# Altium schematic sheet I2C.SchDoc
size A4
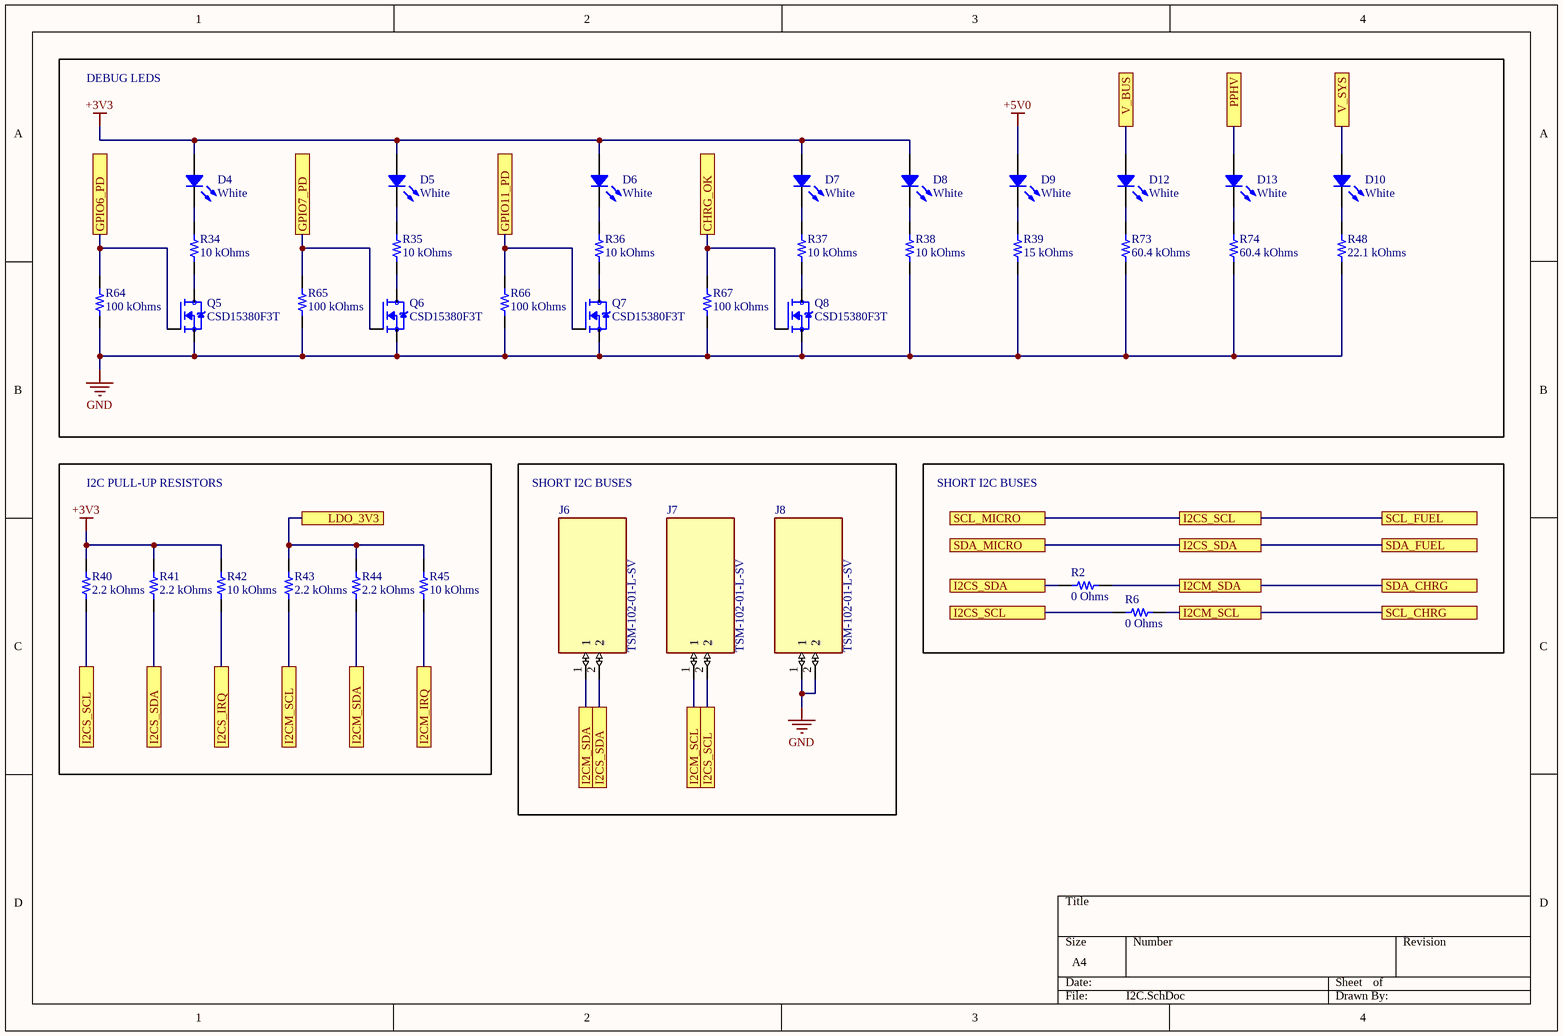
[diagram p0: I2C.SchDoc]

## Parts
D4  White  [LED 0805_2012]  (no BOM)
D5  White  [LED 0805_2012]  (no BOM)
D6  White  [LED 0805_2012]  (no BOM)
D7  White  [LED 0805_2012]  (no BOM)
D8  White  [LED 0805_2012]  (no BOM)
D9  White  [LED 0805_2012]  (no BOM)
D10  White  [LED 0805_2012]  (no BOM)
D12  White  [LED 0805_2012]  (no BOM)
D13  White  [LED 0805_2012]  (no BOM)
J6  TSM-102-01-L-SV  [TSM-102-01-L-SV]  (no BOM)
J7  TSM-102-01-L-SV  [TSM-102-01-L-SV]  (no BOM)
J8  TSM-102-01-L-SV  [TSM-102-01-L-SV]  (no BOM)
Q5  CSD15380F3T  [TRXDFN69X60X35-3N]  (no BOM)
Q6  CSD15380F3T  [TRXDFN69X60X35-3N]  (no BOM)
Q7  CSD15380F3T  [TRXDFN69X60X35-3N]  (no BOM)
Q8  CSD15380F3T  [TRXDFN69X60X35-3N]  (no BOM)
R2  0 Ohms  [RES 0402_1005]
R6  0 Ohms  [RES 0402_1005]
R34  10 kOhms  [RES 0603_1608]  (no BOM)
R35  10 kOhms  [RES 0603_1608]  (no BOM)
R36  10 kOhms  [RES 0603_1608]  (no BOM)
R37  10 kOhms  [RES 0603_1608]  (no BOM)
R38  10 kOhms  [RES 0603_1608]  (no BOM)
R39  15 kOhms  [RES 0402_1005]  (no BOM)
R40  2.2 kOhms  [RES 0402_1005]
R41  2.2 kOhms  [RES 0402_1005]
R42  10 kOhms  [RES 0402_1005]
R43  2.2 kOhms  [RES 0402_1005]
R44  2.2 kOhms  [RES 0402_1005]
R45  10 kOhms  [RES 0402_1005]
R48  22.1 kOhms  [RES 0603_1608]  (no BOM)
R64  100 kOhms  [RES 0402_1005]  (no BOM)
R65  100 kOhms  [RES 0402_1005]  (no BOM)
R66  100 kOhms  [RES 0402_1005]  (no BOM)
R67  100 kOhms  [RES 0402_1005]  (no BOM)
R73  60.4 kOhms  [RES 0603_1608]  (no BOM)
R74  60.4 kOhms  [RES 0603_1608]  (no BOM)

## Blocks framed on the sheet
DEBUG LEDS: D4-D10 D12 D13 Q5-Q8 R34-R39 R48 R64-R67 R73 R74
I2C PULL-UP RESISTORS: R40-R45
SHORT I2C BUSES: J6-J8
SHORT I2C BUSES: R2 R6

## Ports
CHRG_OK, GPIO6_PD, GPIO7_PD, GPIO11_PD, I2CM_IRQ, I2CM_SCL, I2CM_SDA, I2CS_IRQ, I2CS_SCL, I2CS_SDA, LDO_3V3, PPHV, SCL_CHRG, SCL_FUEL, SCL_MICRO, SDA_CHRG, SDA_FUEL, SDA_MICRO, V_BUS, V_SYS

## Nets
+3V3: D4.1 D5.1 D6.1 D7.1 D8.1 R40.2 R41.2 R42.2
+5V0: D9.1
GND: J8.1 J8.2 Q5.2(S) Q6.2(S) Q7.2(S) Q8.2(S) R38.1 R39.1 R48.1 R64.1 R65.1 R66.1 R67.1 R73.1 R74.1
CHRG_OK: Q8.1(G) R67.2 ; port CHRG_OK
GPIO6_PD: Q5.1(G) R64.2 ; port GPIO6_PD
GPIO7_PD: Q6.1(G) R65.2 ; port GPIO7_PD
GPIO11_PD: Q7.1(G) R66.2 ; port GPIO11_PD
I2CM_IRQ: R45.1 ; port I2CM_IRQ
I2CM_SCL: J7.1 R6.2 R43.1 ; port SCL_CHRG, port I2CM_SCL
I2CM_SDA: J6.1 R2.2 R44.1 ; port SDA_CHRG, port I2CM_SDA
I2CS_IRQ: R42.1 ; port I2CS_IRQ
I2CS_SCL: J7.2 R6.1 R40.1 ; port SCL_MICRO, port I2CS_SCL, port SCL_FUEL
I2CS_SDA: J6.2 R2.1 R41.1 ; port SDA_MICRO, port I2CS_SDA, port SDA_FUEL
LDO_3V3: R43.2 R44.2 R45.2 ; port LDO_3V3
PPHV: D13.1 ; port PPHV
V_BUS: D12.1 ; port V_BUS
V_SYS: D10.1 ; port V_SYS
NetD4_2: D4.2 R34.2
NetD5_2: D5.2 R35.2
NetD6_2: D6.2 R36.2
NetD7_2: D7.2 R37.2
NetD8_2: D8.2 R38.2
NetD9_2: D9.2 R39.2
NetD10_2: D10.2 R48.2
NetD12_2: D12.2 R73.2
NetD13_2: D13.2 R74.2
NetQ5_3: Q5.3(D) R34.1
NetQ6_3: Q6.3(D) R35.1
NetQ7_3: Q7.3(D) R36.1
NetQ8_3: Q8.3(D) R37.1

## Library data of the parts
D4-D10 D12 D13 = QBLP631-IW5: 0805 LED WHITE, YELLOW DIFFUSED; Manufacturer: QT Brightek (QTB); Configuration: Standard; Current - Test: 5mA; Lens Size: 1.30mm x 1.25mm; Lens Style: Rectangle with Flat Top; Millicandela Rating: 85mcd; Viewing Angle: 140°; Voltage - Forward (Vf) (Typ): 2.9V; Part Number: QBLP631-IW5; Color: White; ComponentLink1Description: Datasheet; ComponentLink1URL: https://www.qt-brightek.com/datasheet/QBLP631-IW5.pdf; ComponentLink2Description: DigiKey Link; ComponentLink2URL: https://www.digikey.com/en/products/detail/qt-brightek-qtb/QBLP631-IW5/16499651; Device Package: 0805 (2012 Metric); Height (Max): 0.90mm; LastUpdated: 9/08/2022 12:43:05 PM; Lens Color: Yellow; Lens Transparency: Diffused; Lifecycle Status: Active; Minimum Order: 1; Mounting Type: Surface Mount; Package / Case: 0805 (2012 Metric); Packaging: TapeAndReel; PartId: 1097; Part Status: Active; Price: 0.08; Series: QBLP631; Size / Dimension: 2.00mm L x 1.25mm W; Supplier 1: DigiKey; Supplier Part Number 1: 1516-QBLP631-IW5CT-ND; Supplier Device Package: 0805; Value: White
J6-J8 = TSM-102-01-L-SV: MF: {'manufacturer': u'Samtec Inc.'}; Value: *; Package: None; Price: None; MP: TSM-102-01-L-SV; Availability: Unavailable
Q5-Q8 = CSD15380F3T: 20-V N-Channel FemtoFET MOSFET 3-PICOSTAR -55 to 150; MF: {'manufacturer': u'Texas Instruments'}; Value: *; Package: None; Price: None; MP: CSD15380F3T; Availability: Unavailable
R2 R6 = CRCW04020000Z0EDHP: RES SMD 0 OHM JUMPER 1/5W 0402; Manufacturer: Vishay Dale; Power (Watts): 0.2W, 1/5W; Part Number: CRCW04020000Z0EDHP; Value: 0 Ohms; ComponentLink1Description: Datasheet; ComponentLink1URL: http://www.vishay.com/docs/20043/crcwhpe3.pdf; ComponentLink2Description: DigiKey Link; ComponentLink2URL: https://www.digikey.com/en/products/detail/vishay-dale/CRCW04020000Z0EDHP/2222496; Composition: Thick Film; Device Package: 0402 (1005 Metric); Features: Automotive AEC-Q200, Pulse Withstanding; Height - Seated (Max): 0.016" (0.40mm); LastUpdated: 7/09/2023 7:26:17 PM; Lifecycle Status: Active; Minimum Order: 1; Number of Terminations: 2; Operating Temperature: -55°C ~ 155°C; Package / Case: 0402 (1005 Metric); Packaging: TapeAndReel; PartId: 3131; Part Status: Active; Price: 0.01; Ratings: AEC-Q200; Resistance: 0 Ohms; Series: CRCW-HP; Size / Dimension: 0.039" L x 0.020" W (1.00mm x 0.50mm); Supplier 1: DigiKey; Supplier Part Number 1: 541-0.0YBCT-ND; Supplier Device Package: 0402; Tolerance: Jumper
R34-R38 = CR0603-JW-103EAS: RES 10K OHM 5% 0.01W 0603; Manufacturer: Bourns Inc.; Temperature Coefficient: ±200ppm/°C; Part Number: CR0603-JW-103EAS; Value: 10 kOhms; ComponentLink1Description: Datasheet; ComponentLink1URL: https://www.bourns.com/docs/Product-Datasheets/CR0603-AS.pdf; ComponentLink2Description: DigiKey Link; ComponentLink2URL: http://digikey.com/product-detail/en/bourns-inc/CR0603-JW-103EAS/CR0603-JW-103EASCT-ND/6830121; Composition: Thick Film; Device Package: 0603 (1608 Metric); Features: Anti-Sulfur; Height - Seated (Max): 0.024" (0.60mm); LastUpdated: 27/04/2023 7:33:47 PM; Lifecycle Status: Active; Minimum Order: 1; Number of Terminations: 2; Operating Temperature: -55°C ~ 155°C; Package / Case: 0603 (1608 Metric); Packaging: CutTape; PartId: 22277; Part Status: Active; Power (Watts): 0.01W; Price: 0.10; Resistance: 10 kOhms; Series: CR0603-AS; Size / Dimension: 0.063" L x 0.031" W (1.60mm x 0.80mm); Supplier 1: DigiKey; Supplier Part Number 1: CR0603-JW-103EASCT-ND; Supplier Device Package: 0603; Tolerance: ±5%
R39 = RC0402FR-1315KL: RES 15K OHM 1% 1/16W 0402; Manufacturer: Yageo; Power (Watts): 0.063W, 1/16W; Temperature Coefficient: ±100ppm/°C; Part Number: RC0402FR-1315KL; Value: 15 kOhms; ComponentLink1Description: Datasheet; ComponentLink1URL: https://www.yageo.com/upload/media/product/productsearch/datasheet/rchip/PYu-RC_Group_51_RoHS_L_11.pdf; ComponentLink2Description: DigiKey Link; ComponentLink2URL: https://www.digikey.com/en/products/detail/yageo/RC0402FR-1315KL/13694190; Composition: Thick Film; Device Package: 0402 (1005 Metric); Features: Moisture Resistant; Height - Seated (Max): 0.016" (0.40mm); LastUpdated: 14/08/2022 9:22:52 PM; Lifecycle Status: Active; Minimum Order: 50000; Number of Terminations: 2; Operating Temperature: -55°C ~ 155°C; Package / Case: 0402 (1005 Metric); PartId: 65094; Part Status: Active; Price: 0; Resistance: 15 kOhms; Series: RC_L; Size / Dimension: 0.039" L x 0.020" W (1.00mm x 0.50mm); Supplier 1: DigiKey; Supplier Part Number 1: 13-RC0402FR-1315KLTR-ND; Supplier Device Package: 0402; Tolerance: ±1%
R40 R41 R43 R44 = RC0402FR-132K2L: RES 2.2K OHM 1% 1/16W 0402; Manufacturer: Yageo; Power (Watts): 0.063W, 1/16W; Temperature Coefficient: ±100ppm/°C; Part Number: RC0402FR-132K2L; Value: 2.2 kOhms; ComponentLink1Description: Datasheet; ComponentLink1URL: https://www.yageo.com/upload/media/product/productsearch/datasheet/rchip/PYu-RC_Group_51_RoHS_L_11.pdf; ComponentLink2Description: DigiKey Link; ComponentLink2URL: https://www.digikey.com/en/products/detail/yageo/RC0402FR-132K2L/13694070; Composition: Thick Film; Device Package: 0402 (1005 Metric); Features: Moisture Resistant; Height - Seated (Max): 0.016" (0.40mm); LastUpdated: 26/04/2023 7:19:35 PM; Lifecycle Status: Active; Minimum Order: 50000; Number of Terminations: 2; Operating Temperature: -55°C ~ 155°C; Package / Case: 0402 (1005 Metric); PartId: 64946; Part Status: Active; Price: 0; Resistance: 2.2 kOhms; Series: RC_L; Size / Dimension: 0.039" L x 0.020" W (1.00mm x 0.50mm); Supplier 1: DigiKey; Supplier Part Number 1: 13-RC0402FR-132K2LTR-ND; Supplier Device Package: 0402; Tolerance: ±1%
R42 R45 = RC0402JR-1310KL: RES 10K OHM 5% 1/16W 0402; Manufacturer: Yageo; Power (Watts): 0.063W, 1/16W; Temperature Coefficient: ±100ppm/°C; Part Number: RC0402JR-1310KL; Value: 10 kOhms; ComponentLink1Description: Datasheet; ComponentLink1URL: https://www.yageo.com/upload/media/product/productsearch/datasheet/rchip/PYu-RC_Group_51_RoHS_L_11.pdf; ComponentLink2Description: DigiKey Link; ComponentLink2URL: https://www.digikey.com/en/products/detail/yageo/RC0402JR-1310KL/13694115; Composition: Thick Film; Device Package: 0402 (1005 Metric); Features: Moisture Resistant; Height - Seated (Max): 0.016" (0.40mm); LastUpdated: 4/04/2023 7:21:31 PM; Lifecycle Status: Active; Minimum Order: 50000; Number of Terminations: 2; Operating Temperature: -55°C ~ 155°C; Package / Case: 0402 (1005 Metric); PartId: 69237; Part Status: Active; Price: 0; Resistance: 10 kOhms; Series: RC_L; Size / Dimension: 0.039" L x 0.020" W (1.00mm x 0.50mm); Supplier 1: DigiKey; Supplier Part Number 1: 13-RC0402JR-1310KLTR-ND; Supplier Device Package: 0402; Tolerance: ±5%
R48 = RMCF0603FT22K1: RES 22.1K OHM 1% 1/10W 0603; Manufacturer: Stackpole Electronics Inc; Power (Watts): 0.1W, 1/10W; Temperature Coefficient: ±100ppm/°C; Part Number: RMCF0603FT22K1; Value: 22.1 kOhms; ComponentLink1Description: Datasheet; ComponentLink1URL: https://www.seielect.com/catalog/sei-rmcf_rmcp.pdf; ComponentLink2Description: DigiKey Link; ComponentLink2URL: https://www.digikey.com/en/products/detail/stackpole-electronics-inc/RMCF0603FT22K1/1760764; Composition: Thick Film; Device Package: 0603 (1608 Metric); Features: Automotive AEC-Q200; Height - Seated (Max): 0.022" (0.55mm); LastUpdated: 10/05/2023 7:38:01 PM; Lifecycle Status: Active; Minimum Order: 1; Number of Terminations: 2; Operating Temperature: -55°C ~ 155°C; Package / Case: 0603 (1608 Metric); Packaging: CutTape; PartId: 6076; Part Status: Active; Price: 0.01; Ratings: AEC-Q200; Resistance: 22.1 kOhms; Series: RMCF; Size / Dimension: 0.061" L x 0.031" W (1.55mm x 0.80mm); Supplier 1: DigiKey; Supplier Part Number 1: RMCF0603FT22K1CT-ND; Supplier Device Package: 0603; Tolerance: ±1%
R64-R67 = RT0402FRE07100KL: RES SMD 100K OHM 1% 1/16W 0402; Manufacturer: Yageo; Power (Watts): 0.063W, 1/16W; Temperature Coefficient: ±50ppm/°C; Part Number: RT0402FRE07100KL; Value: 100 kOhms; ComponentLink1Description: Datasheet; ComponentLink1URL: https://www.yageo.com/upload/media/product/productsearch/datasheet/rchip/PYu-RT_1-to-0.01_RoHS_L_11.pdf; ComponentLink2Description: DigiKey Link; ComponentLink2URL: https://www.digikey.com/en/products/detail/yageo/RT0402FRE07100KL/1071698; Composition: Thin Film; Device Package: 0402 (1005 Metric); Height - Seated (Max): 0.014" (0.35mm); LastUpdated: 26/04/2023 7:20:40 PM; Lifecycle Status: Active; Minimum Order: 1; Number of Terminations: 2; Operating Temperature: -55°C ~ 155°C; Package / Case: 0402 (1005 Metric); Packaging: TapeAndReel; PartId: 3190; Part Status: Active; Price: 0.01; Resistance: 100 kOhms; Series: RT; Size / Dimension: 0.039" L x 0.020" W (1.00mm x 0.50mm); Supplier 1: DigiKey; Supplier Part Number 1: YAG2307CT-ND; Supplier Device Package: 0402; Tolerance: ±1%
R73 R74 = CRCW060360K4FKEA: RES SMD 60.4K OHM 1% 1/10W 0603; Manufacturer: Vishay Dale; Power (Watts): 0.1W, 1/10W; Temperature Coefficient: ±100ppm/°C; Part Number: CRCW060360K4FKEA; Value: 60.4 kOhms; ComponentLink1Description: Datasheet; ComponentLink1URL: http://www.vishay.com/docs/20035/dcrcwe3.pdf; ComponentLink2Description: DigiKey Link; ComponentLink2URL: https://www.digikey.com/en/products/detail/vishay-dale/CRCW060360K4FKEA/1174871; Composition: Thick Film; Device Package: 0603 (1608 Metric); Features: Automotive AEC-Q200; Height - Seated (Max): 0.020" (0.50mm); LastUpdated: 7/05/2023 7:36:13 PM; Lifecycle Status: Active; Minimum Order: 1; Number of Terminations: 2; Operating Temperature: -55°C ~ 155°C; Package / Case: 0603 (1608 Metric); Packaging: CutTape; PartId: 5182; Part Status: Active; Price: 0.01; Ratings: AEC-Q200; Resistance: 60.4 kOhms; Series: CRCW; Size / Dimension: 0.061" L x 0.033" W (1.55mm x 0.85mm); Supplier 1: DigiKey; Supplier Part Number 1: 541-60.4KHCT-ND; Supplier Device Package: 0603; Tolerance: ±1%